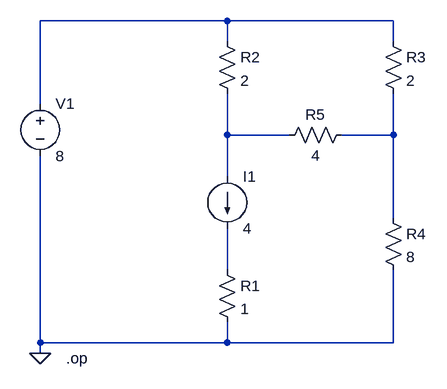
[diagram p0: schematic CH03-KP1-07.asc]
CH03-KP1-07.asc, the LTspice schematic file:
Version 4
SHEET 1 880 680
WIRE 224 144 -64 144
WIRE 480 144 224 144
WIRE 224 176 224 144
WIRE 480 176 480 144
WIRE -64 272 -64 144
WIRE 224 320 224 256
WIRE 320 320 224 320
WIRE 480 320 480 256
WIRE 480 320 400 320
WIRE 224 384 224 320
WIRE 480 448 480 320
WIRE 224 528 224 464
WIRE -64 640 -64 352
WIRE 224 640 224 608
WIRE 224 640 -64 640
WIRE 480 640 480 528
WIRE 480 640 224 640
WIRE -64 656 -64 640
FLAG -64 656 0
SYMBOL voltage -64 256 R0
SYMATTR InstName V1
SYMATTR Value 8
SYMBOL current 224 384 R0
SYMATTR InstName I1
SYMATTR Value 4
SYMBOL res 208 512 R0
SYMATTR InstName R1
SYMATTR Value 1
SYMBOL res 208 160 R0
SYMATTR InstName R2
SYMATTR Value 2
SYMBOL res 464 160 R0
SYMATTR InstName R3
SYMATTR Value 2
SYMBOL res 464 432 R0
SYMATTR InstName R4
SYMATTR Value 8
SYMBOL res 416 304 R90
WINDOW 0 0 56 VBottom 2
WINDOW 3 32 56 VTop 2
SYMATTR InstName R5
SYMATTR Value 4
TEXT -24 664 Left 2 !.op

The netlist it stands for:
* CH03-KP1-07.asc
V1 N001 0 8
I1 N002 N004 4
R1 N004 0 1
R2 N001 N002 2
R3 N001 N003 2
R4 N003 0 8
R5 N003 N002 4
.op
.backanno
.end